# Altium project 2_Smoke_detector.PrjPcb (part 5 of 6)
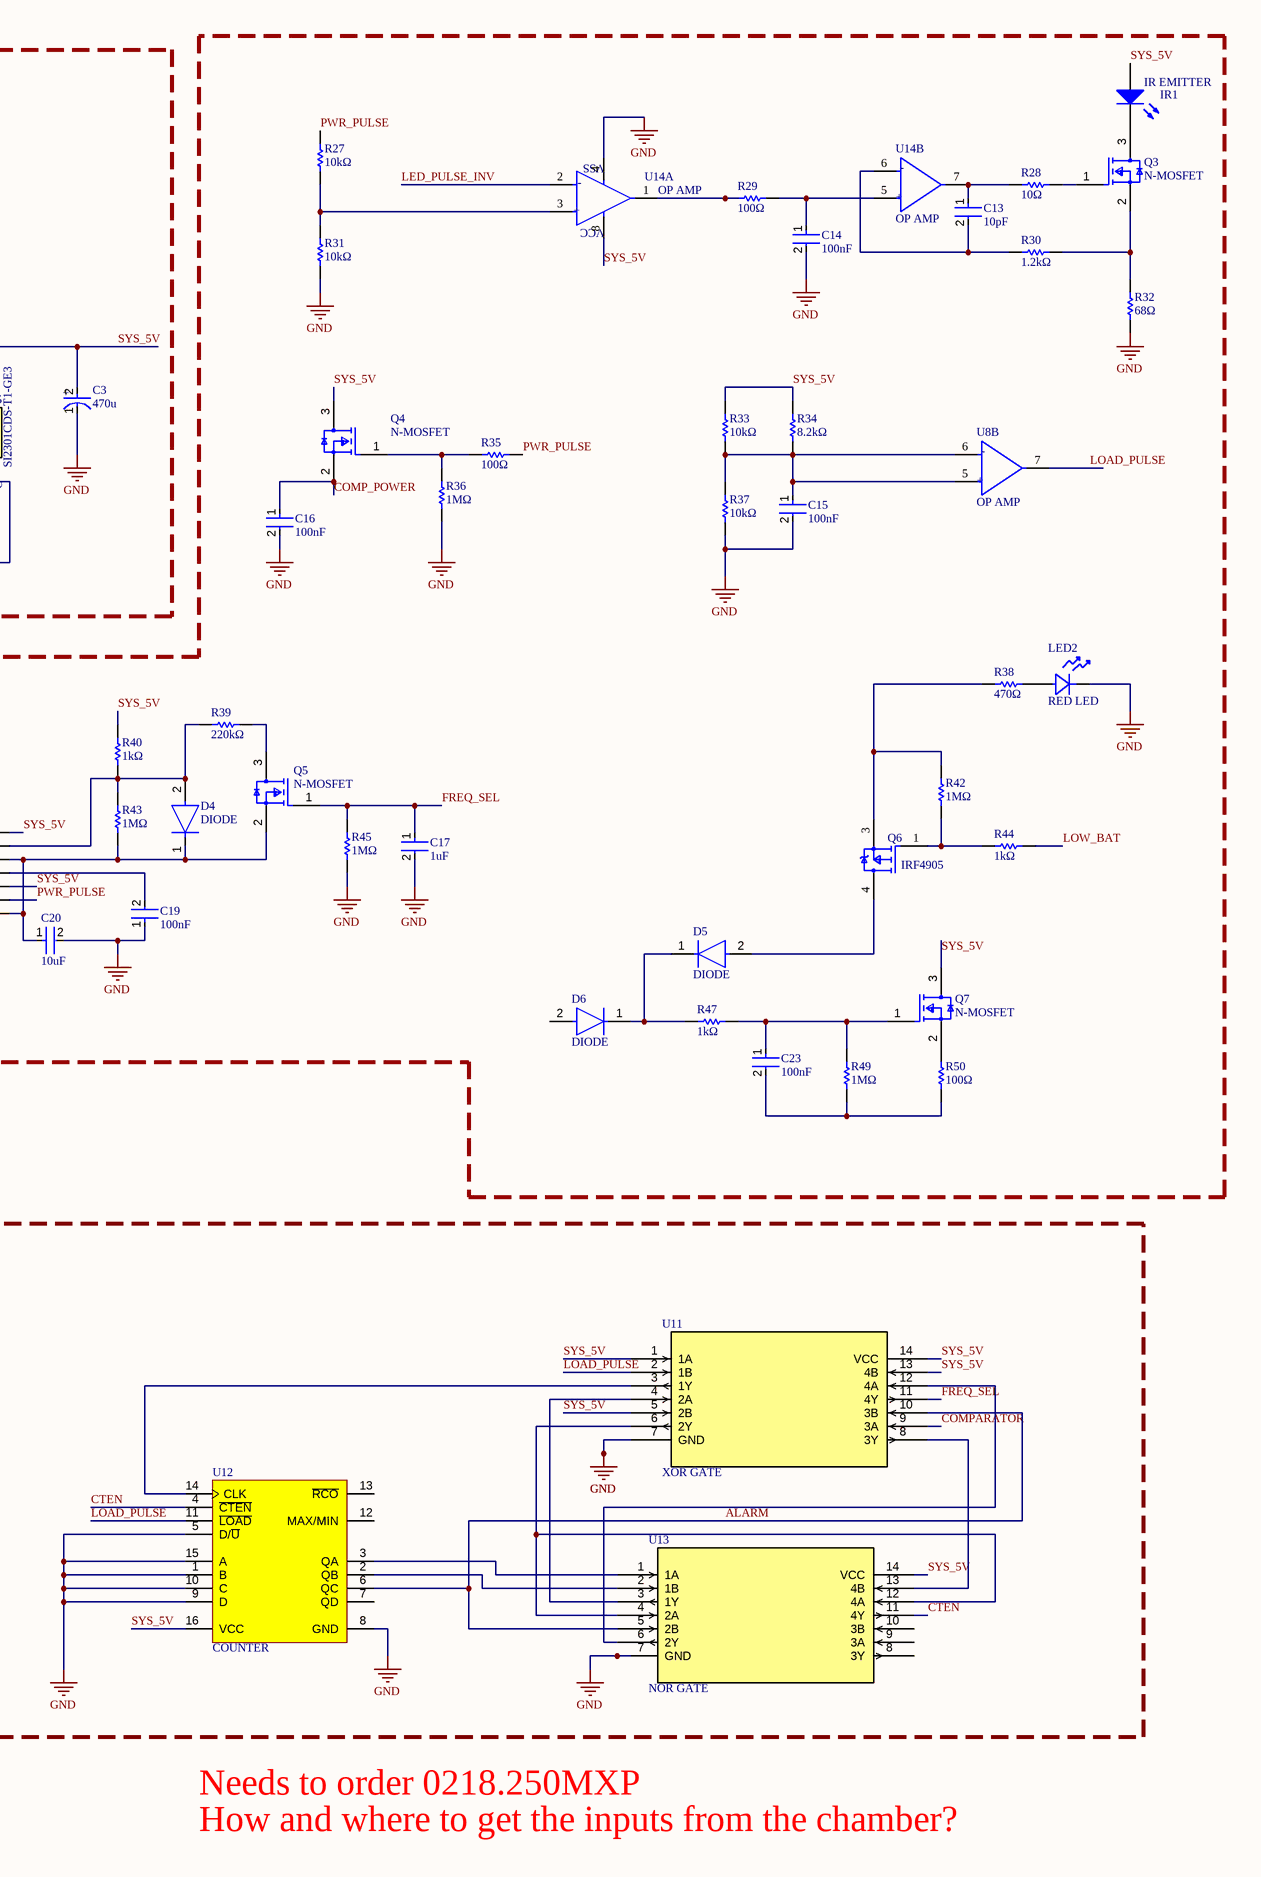
[diagram p5: 2_Smoke_detector.SchDoc, right]

## Sheet 2_Smoke_detector.SchDoc (continued)

### Library data of the parts (continued)
R19 R29 R35 R50 = CRCW0805100RFKEA: RES 100Ω ±1% 125mW 0805; Manufacturer: Vishay; Manufacturer Package Identifier: CRCW0805-e3; Temperature Coefficient: 100ppm/°C; Voltage Rating: 150V; Supplier: Future Electronics; Supplier Part Number: CRCW0805100RFKEA; Manufacturer Part Number: CRCW0805100RFKEA; RoHS: Compliant; Category: Chip SMD Resistors; Stock: 3045000; Pricing: 10000=0.0023, 50000=0.0022, 125000=0.0021, 375000=0.0021, 750000=0.002 (USD); Case/Package: 0805; Case Code (Imperial): 0805; China RoHS: Non-Compliant; Composition: Thick Film; Contact Plating: Tin; Country of Origin: Israel; Depth: 1.25mm; Export Control Classification Number (ECCN) Code: EAR99; Features: Automotive AEC-Q200; Height: 450µm; Harmonized Tariff Schedule (HTS) Code: 8533.21.00.30; Introduction Date: 2005-02-16; Lead Free: Lead Free; Length: 2mm; Lifecycle Status: Production; Max Operating Temperature: 155°C; Max Power Dissipation: 125mW; Military Standard: Not; Min Operating Temperature: -55°C; Mounting Technology: Surface Mount; Pins: 2; Number of Terminals: 2; Number of Terminations: 2; Power Rating: 125mW; Radiation Hardening: No; Ratings: AEC-Q200; REACH SVHC: Unaffected; Value: 100Ω; Schedule B: 8533210045, 8533210045|8533210045|8533210045|8533210045|8533210045|8533210045|8533210045|8533210045|8533210045|8533210045|8533210045|8533210045|8533210045|8533210045|8533210045|8533210045|8533210045|8533210045|8533210045|8533210045|8533210045|8533210045|8533210045|85; Termination: SMD/SMT; Tolerance: 1%; Voltage Rating (DC): 150V; Weight: 5.499807mg; Width: 1.25mm; Working Voltage: 150V; ComponentLink1URL: https://datasheet.octopart.com:443/CRCW0805100RFKEA-Vishay-datasheet-175423584.pdf?src-supplier=IHS; ComponentLink1Description: https://datasheet.octopart.com:443/CRCW0805100RFKEA-Vishay-datasheet-175423584.pdf?src-supplier=IHS; ComponentLink2URL: https://datasheet.octopart.com:443/CRCW0805100RFKEA-Vishay-datasheet-83961561.pdf?src-supplier=Newark; ComponentLink2Description: https://datasheet.octopart.com:443/CRCW0805100RFKEA-Vishay-datasheet-83961561.pdf?src-supplier=Newark; ComponentLink3URL: https://datasheet.octopart.com:443/CRCW0805100RFKEA-Vishay-datasheet-11516975.pdf?src-supplier=Newark; ComponentLink3Description: https://datasheet.octopart.com:443/CRCW0805100RFKEA-Vishay-datasheet-11516975.pdf?src-supplier=Newark; ComponentLink4URL: https://datasheet.octopart.com:443/CRCW0805100RFKEA-Vishay-datasheet-41302739.pdf?src-supplier=Newark; ComponentLink4Description: https://datasheet.octopart.com:443/CRCW0805100RFKEA-Vishay-datasheet-41302739.pdf?src-supplier=Newark; ComponentLink5URL: https://datasheet.octopart.com:443/CRCW0805100RFKEA-Vishay-datasheet-33013972.pdf?src-supplier=Newark; ComponentLink5Description: https://datasheet.octopart.com:443/CRCW0805100RFKEA-Vishay-datasheet-33013972.pdf?src-supplier=Newark; ComponentLink6URL: https://datasheet.octopart.com:443/CRCW0805100RFKEA-Vishay-datasheet-62317937.pdf?src-supplier=element14+APAC; ComponentLink6Description: https://datasheet.octopart.com:443/CRCW0805100RFKEA-Vishay-datasheet-62317937.pdf?src-supplier=element14+APAC; ComponentLink7URL: https://datasheet.octopart.com:443/CRCW0805100RFKEA-Vishay-datasheet-14722531.pdf?src-supplier=element14+APAC; ComponentLink7Description: https://datasheet.octopart.com:443/CRCW0805100RFKEA-Vishay-datasheet-14722531.pdf?src-supplier=element14+APAC; ComponentLink8URL: https://datasheet.octopart.com:443/CRCW0805100RFKEA.-Vishay-datasheet-78776209.pdf?src-supplier=element14+APAC; ComponentLink8Description: https://datasheet.octopart.com:443/CRCW0805100RFKEA.-Vishay-datasheet-78776209.pdf?src-supplier=element14+APAC; ComponentLink9URL: https://datasheet.octopart.com:443/CRCW0805100RFKEA-Vishay-datasheet-66077789.pdf?src-supplier=element14+APAC; ComponentLink9Description: https://datasheet.octopart.com:443/CRCW0805100RFKEA-Vishay-datasheet-66077789.pdf?src-supplier=element14+APAC; ComponentLink10URL: https://datasheet.octopart.com:443/CRCW0805100RFKEA-Vishay-datasheet-16179825.pdf?src-supplier=element14+APAC; ComponentLink10Description: https://datasheet.octopart.com:443/CRCW0805100RFKEA-Vishay-datasheet-16179825.pdf?src-supplier=element14+APAC; ComponentLink11URL: https://datasheet.octopart.com:443/CRCW0805100RFKEA-Vishay-datasheet-5300368.pdf?src-supplier=Future+Electronics; ComponentLink11Description: https://datasheet.octopart.com:443/CRCW0805100RFKEA-Vishay-datasheet-5300368.pdf?src-supplier=Future+Electronics; ComponentLink12URL: https://datasheet.octopart.com:443/CRCW0805100RFKEA-Vishay-datasheet-62316122.pdf?src-supplier=Future+Electronics; ComponentLink12Description: https://datasheet.octopart.com:443/CRCW0805100RFKEA-Vishay-datasheet-62316122.pdf?src-supplier=Future+Electronics; ComponentLink13URL: https://datasheet.octopart.com:443/CRCW0805100RFKEA-Vishay-datasheet-5306405.pdf?src-supplier=RS+(Formerly+Allied+Electronics); ComponentLink13Description: https://datasheet.octopart.com:443/CRCW0805100RFKEA-Vishay-datasheet-5306405.pdf?src-supplier=RS+(Formerly+Allied+Electronics); ComponentLink14URL: https://datasheet.octopart.com:443/CRCW0805100RFKEA-Vishay-Dale-datasheet-47688880.pdf?src-supplier=RS+(Formerly+Allied+Electronics); ComponentLink14Description: https://datasheet.octopart.com:443/CRCW0805100RFKEA-Vishay-Dale-datasheet-47688880.pdf?src-supplier=RS+(Formerly+Allied+Electronics); ComponentLink15URL: https://datasheet.octopart.com:443/CRCW0805100RFKEA-Vishay-datasheet-12001583.pdf?src-supplier=RS+(Formerly+Allied+Electronics); ComponentLink15Description: https://datasheet.octopart.com:443/CRCW0805100RFKEA-Vishay-datasheet-12001583.pdf?src-supplier=RS+(Formerly+Allied+Electronics); ComponentLink16URL: https://datasheet.octopart.com:443/CRCW0805100RFKEA-Vishay-datasheet-149165818.pdf?src-supplier=HQonline; ComponentLink16Description: https://datasheet.octopart.com:443/CRCW0805100RFKEA-Vishay-datasheet-149165818.pdf?src-supplier=HQonline; ComponentLink17URL: https://datasheet.octopart.com:443/CRCW0805100RFKEA-Vishay-datasheet-17834126.pdf?src-supplier=TME; ComponentLink17Description: https://datasheet.octopart.com:443/CRCW0805100RFKEA-Vishay-datasheet-17834126.pdf?src-supplier=TME; ComponentLink18URL: https://datasheet.octopart.com:443/CRCW0805100RFKEA-Vishay-datasheet-13242068.pdf?src-supplier=Farnell; ComponentLink18Description: https://datasheet.octopart.com:443/CRCW0805100RFKEA-Vishay-datasheet-13242068.pdf?src-supplier=Farnell; ComponentLink19URL: https://datasheet.octopart.com:443/CRCW0805100RFKEA-Vishay-datasheet-13195083.pdf?src-supplier=Farnell; ComponentLink19Description: https://datasheet.octopart.com:443/CRCW0805100RFKEA-Vishay-datasheet-13195083.pdf?src-supplier=Farnell; ComponentLink20URL: https://datasheet.octopart.com:443/CRCW0805100RFKEA-Vishay-datasheet-13034211.pdf?src-supplier=Farnell; ComponentLink20Description: https://datasheet.octopart.com:443/CRCW0805100RFKEA-Vishay-datasheet-13034211.pdf?src-supplier=Farnell; ComponentLink21URL: https://datasheet.octopart.com:443/CRCW0805100RFKEA-Vishay-datasheet-12600034.pdf?src-supplier=Farnell; ComponentLink21Description: https://datasheet.octopart.com:443/CRCW0805100RFKEA-Vishay-datasheet-12600034.pdf?src-supplier=Farnell; ComponentLink22URL: https://datasheet.octopart.com:443/CRCW0805100RFKEA-Vishay-datasheet-12532161.pdf?src-supplier=Farnell; ComponentLink22Description: https://datasheet.octopart.com:443/CRCW0805100RFKEA-Vishay-datasheet-12532161.pdf?src-supplier=Farnell; ComponentLink23URL: https://datasheet.octopart.com:443/CRCW0805100RFKEA-Vishay-datasheet-12517896.pdf?src-supplier=Farnell; ComponentLink23Description: https://datasheet.octopart.com:443/CRCW0805100RFKEA-Vishay-datasheet-12517896.pdf?src-supplier=Farnell; ComponentLink24URL: https://datasheet.octopart.com:443/CRCW0805100RFKEA-Vishay-datasheet-12509762.pdf?src-supplier=Farnell; ComponentLink24Description: https://datasheet.octopart.com:443/CRCW0805100RFKEA-Vishay-datasheet-12509762.pdf?src-supplier=Farnell; ComponentLink25URL: https://datasheet.octopart.com:443/CRCW0805100RFKEA-Vishay-datasheet-10322335.pdf?src-supplier=Farnell; ComponentLink25Description: https://datasheet.octopart.com:443/CRCW0805100RFKEA-Vishay-datasheet-10322335.pdf?src-supplier=Farnell; ComponentLink26URL: https://datasheet.octopart.com:443/CRCW0805100RFKEA-Vishay-datasheet-8788789.pdf?src-supplier=Farnell; ComponentLink26Description: https://datasheet.octopart.com:443/CRCW0805100RFKEA-Vishay-datasheet-8788789.pdf?src-supplier=Farnell; ComponentLink27URL: https://datasheet.octopart.com:443/CRCW0805100RFKEA-Vishay-datasheet-8361388.pdf?src-supplier=Farnell; ComponentLink27Description: https://datasheet.octopart.com:443/CRCW0805100RFKEA-Vishay-datasheet-8361388.pdf?src-supplier=Farnell; ComponentLink28URL: https://datasheet.octopart.com:443/CRCW0805100RFKEA-Vishay-datasheet-546287.pdf?src-supplier=Farnell; ComponentLink28Description: https://datasheet.octopart.com:443/CRCW0805100RFKEA-Vishay-datasheet-546287.pdf?src-supplier=Farnell; ComponentLink29URL: https://datasheet.octopart.com:443/CRCW0805100RFKEA-Vishay-datasheet-11540273.pdf?src-supplier=Arrow+Electronics; ComponentLink29Description: https://datasheet.octopart.com:443/CRCW0805100RFKEA-Vishay-datasheet-11540273.pdf?src-supplier=Arrow+Electronics; ComponentLink30URL: https://datasheet.octopart.com:443/CRCW0805100RFKEA-Vishay-datasheet-8445837.pdf?src-supplier=element14; ComponentLink30Description: https://datasheet.octopart.com:443/CRCW0805100RFKEA-Vishay-datasheet-8445837.pdf?src-supplier=element14; ComponentLink31URL: https://datasheet.octopart.com:443/CRCW0805100RFKEA-Vishay-datasheet-5377306.pdf?src-supplier=Garrett; ComponentLink31Description: https://datasheet.octopart.com:443/CRCW0805100RFKEA-Vishay-datasheet-5377306.pdf?src-supplier=Garrett; ComponentLink32URL: https://datasheet.octopart.com:443/CRCW0805100RFKEA-Vishay-datasheet-148188.pdf?src-supplier=Garrett; ComponentLink32Description: https://datasheet.octopart.com:443/CRCW0805100RFKEA-Vishay-datasheet-148188.pdf?src-supplier=Garrett; ComponentLink33URL: https://datasheet.octopart.com:443/CRCW0805100RFKEA-Vishay-datasheet-34203.pdf?src-supplier=Garrett; ComponentLink33Description: https://datasheet.octopart.com:443/CRCW0805100RFKEA-Vishay-datasheet-34203.pdf?src-supplier=Garrett; ComponentLink34URL: http://sigma.octopart.com:80/rohs_statement/Vishay-company-15.pdf?src-supplier=Compliance+Statements; ComponentLink34Description: http://sigma.octopart.com:80/rohs_statement/Vishay-company-15.pdf?src-supplier=Compliance+Statements; LCSC Part Number: C844936
R21 = RC0805FR-07499KL: RES 499kΩ ±1% 125mW 0805; Manufacturer: Yageo Group; Temperature Coefficient: 100ppm/°C; Voltage Rating: 150V; Supplier: Future Electronics; Supplier Part Number: RC0805FR-07499KL; Manufacturer Part Number: RC0805FR-07499KL; RoHS: Compliant; Category: Chip SMD Resistors; Stock: 850000; Pricing: 5000=0.0068, 20000=0.0066, 75000=0.0064, 150000=0.0063, 375000=0.006 (USD); Case/Package: 0805; Case Code (Imperial): 0805; China RoHS: Non-Compliant; Composition: Thick Film; Contact Plating: Lead, Tin; Country of Origin: Mainland China, Taiwan; Depth: 1.25mm; Export Control Classification Number (ECCN) Code: EAR99; Height: 500µm; Harmonized Tariff Schedule (HTS) Code: 8533.21.00.30; Introduction Date: 2004-09-22; Lead Free: Lead Free; Length: 2mm; Lifecycle Status: Production; Max Operating Temperature: 155°C; Military Standard: Not; Min Operating Temperature: -55°C; Mounting Technology: Surface Mount; Number of Terminals: 2; Packaging: Tape & Reel; Power Rating: 125mW; Radiation Hardening: No; REACH SVHC: Unaffected; Value: 499kΩ; Schedule B: 8533210045, 8533210045|8533210045, 8533210045|8533210045|8533210045, 8533210045|8533210045|8533210045|8533210045; Termination: SMD/SMT; Tolerance: 1%; Voltage Rating (DC): 150V; Width: 1.25mm; Working Voltage: 150V; ComponentLink1URL: https://datasheet.octopart.com:443/RC0805FR-07499KL-Yageo-datasheet-175887523.pdf?src-supplier=Newark; ComponentLink1Description: https://datasheet.octopart.com:443/RC0805FR-07499KL-Yageo-datasheet-175887523.pdf?src-supplier=Newark; ComponentLink2URL: https://datasheet.octopart.com:443/RC0805FR-07499KL-Yageo-datasheet-103092701.pdf?src-supplier=Upverter; ComponentLink2Description: https://datasheet.octopart.com:443/RC0805FR-07499KL-Yageo-datasheet-103092701.pdf?src-supplier=Upverter; ComponentLink3URL: https://datasheet.octopart.com:443/RC0805FR-07499KL-Yageo-Group-datasheet-190305687.pdf?src-supplier=Future+Electronics; ComponentLink3Description: https://datasheet.octopart.com:443/RC0805FR-07499KL-Yageo-Group-datasheet-190305687.pdf?src-supplier=Future+Electronics; ComponentLink4URL: https://datasheet.octopart.com:443/RC0805FR-07499KL-Yageo-datasheet-164759695.pdf?src-supplier=Future+Electronics; ComponentLink4Description: https://datasheet.octopart.com:443/RC0805FR-07499KL-Yageo-datasheet-164759695.pdf?src-supplier=Future+Electronics; ComponentLink5URL: https://datasheet.octopart.com:443/RC0805FR-07499KL-Yageo-datasheet-12592811.pdf?src-supplier=Future+Electronics; ComponentLink5Description: https://datasheet.octopart.com:443/RC0805FR-07499KL-Yageo-datasheet-12592811.pdf?src-supplier=Future+Electronics; ComponentLink6URL: https://datasheet.octopart.com:443/RC0805FR-07499KL-Yageo-datasheet-8324252.pdf?src-supplier=Future+Electronics; ComponentLink6Description: https://datasheet.octopart.com:443/RC0805FR-07499KL-Yageo-datasheet-8324252.pdf?src-supplier=Future+Electronics; ComponentLink7URL: https://datasheet.octopart.com:443/RC0805FR-07499KL-Yageo-datasheet-8330313.pdf?src-supplier=TME; ComponentLink7Description: https://datasheet.octopart.com:443/RC0805FR-07499KL-Yageo-datasheet-8330313.pdf?src-supplier=TME; ComponentLink8URL: https://datasheet.octopart.com:443/RC0805FR-07499KL-Yageo-datasheet-79472498.pdf?src-supplier=Megastar; ComponentLink8Description: https://datasheet.octopart.com:443/RC0805FR-07499KL-Yageo-datasheet-79472498.pdf?src-supplier=Megastar; ComponentLink9URL: https://datasheet.octopart.com/RC0805FR-07499KL-Yageo-datasheet-73766026.pdf; ComponentLink9Description: https://datasheet.octopart.com/RC0805FR-07499KL-Yageo-datasheet-73766026.pdf; ComponentLink10URL: https://datasheet.octopart.com:443/RC0805FR-07499KL-Yageo-datasheet-118657.pdf?src-supplier=DigiKey; ComponentLink10Description: https://datasheet.octopart.com:443/RC0805FR-07499KL-Yageo-datasheet-118657.pdf?src-supplier=DigiKey; ComponentLink11URL: http://sigma.octopart.com:80/conflict_mineral_statement/Yageo-company-3.pdf?src-supplier=Compliance+Statements; ComponentLink11Description: http://sigma.octopart.com:80/conflict_mineral_statement/Yageo-company-3.pdf?src-supplier=Compliance+Statements; ComponentLink12URL: http://sigma.octopart.com:80/rohs_statement/Yageo-company-2.pdf?src-supplier=Compliance+Statements; ComponentLink12Description: http://sigma.octopart.com:80/rohs_statement/Yageo-company-2.pdf?src-supplier=Compliance+Statements; LCSC: C274360; LCSC Part Number: C274360
R26 = CRCW080522K0FKEAC: RES 22kΩ 1% 1/8W 0805; Manufacturer: Vishay; Power Rating: 125mW; Temperature Coefficient: 100ppm/°C; Working Voltage: 150V; Supplier: Avnet; Supplier Part Number: CRCW080522K0FKEAC; Manufacturer Part Number: CRCW080522K0FKEAC; RoHS: Compliant; Category: Chip SMD Resistors; Stock: 85000; Pricing: 5000=0.00893, 100000=0.00478, 200000=0.00475, 400000=0.00473, 800000=0.0047 (USD); Case/Package: 0805; China RoHS: Non-Compliant; Composition: Thick Film; Contact Plating: Tin; Height: 500µm; Lead Free: Lead Free; Length: 2mm; Lifecycle Status: Production; Max Operating Temperature: 155°C; Min Operating Temperature: -55°C; Mounting Technology: Surface Mount; Number of Terminals: 2; REACH SVHC: Unaffected; Value: 22kΩ; Schedule B: 8533210045, 8533210045|8533210045|8533210045|8533210045|8533210045; Termination: Wraparound; Tolerance: 1%; Width: 1.25mm; ComponentLink1URL: https://datasheet.octopart.com:443/CRCW080522K0FKEAC-Vishay-datasheet-175423585.pdf?src-supplier=IHS; ComponentLink1Description: https://datasheet.octopart.com:443/CRCW080522K0FKEAC-Vishay-datasheet-175423585.pdf?src-supplier=IHS; ComponentLink2URL: https://datasheet.octopart.com:443/CRCW080522K0FKEAC-Vishay-datasheet-102570912.pdf?src-supplier=LCSC; ComponentLink2Description: https://datasheet.octopart.com:443/CRCW080522K0FKEAC-Vishay-datasheet-102570912.pdf?src-supplier=LCSC; ComponentLink3URL: https://datasheet.octopart.com:443/CRCW080522K0FKEAC-Vishay-datasheet-62316122.pdf?src-supplier=Future+Electronics; ComponentLink3Description: https://datasheet.octopart.com:443/CRCW080522K0FKEAC-Vishay-datasheet-62316122.pdf?src-supplier=Future+Electronics; ComponentLink4URL: http://sigma.octopart.com:80/rohs_statement/Vishay-company-15.pdf?src-supplier=Compliance+Statements; ComponentLink4Description: http://sigma.octopart.com:80/rohs_statement/Vishay-company-15.pdf?src-supplier=Compliance+Statements; LCSC Part Number: C844401
R28 = CRCW080510R0FKEA: RES 10Ω ±1% 125mW 0805; Manufacturer: Vishay; Manufacturer Package Identifier: CRCW0805-e3; Temperature Coefficient: 100ppm/°C; Voltage Rating: 150V; Supplier: Future Electronics; Supplier Part Number: CRCW080510R0FKEA; Manufacturer Part Number: CRCW080510R0FKEA; RoHS: Compliant; Category: Chip SMD Resistors; Stock: 2860000; Pricing: 10000=0.0023, 50000=0.0022, 125000=0.0022, 375000=0.0021, 750000=0.002 (USD); Case/Package: 0805; Case Code (Imperial): 0805; China RoHS: Non-Compliant; Composition: Thick Film; Contact Plating: Lead, Tin; Country of Origin: Israel; Depth: 1.25mm; Export Control Classification Number (ECCN) Code: EAR99; Features: Automotive AEC-Q200; Height: 450µm; Harmonized Tariff Schedule (HTS) Code: 8533.21.00.30; Introduction Date: 2005-02-16; Lead Free: Lead Free; Length: 2mm; Lifecycle Status: Production; Max Operating Temperature: 155°C; Max Power Dissipation: 125mW; Military Standard: Not; Min Operating Temperature: -55°C; Mounting Technology: Surface Mount; Pins: 2; Number of Terminals: 2; Number of Terminations: 2; Packaging: Cut Tape; Power Rating: 125mW; Radiation Hardening: No; Ratings: AEC-Q200; REACH SVHC: Unaffected; Value: 10Ω; Schedule B: 8533210045, 8533210045|8533210045|8533210045|8533210045|8533210045|8533210045|8533210045|8533210045|8533210045|8533210045|8533210045|8533210045|8533210045|8533210045|8533210045|8533210045|8533210045|8533210045|8533210045|8533210045|8533210045|8533210045|8533210045|85; Termination: SMD/SMT; Tolerance: 1%; Voltage Rating (DC): 150V; Weight: 5.499807mg; Width: 1.25mm; Working Voltage: 150V; ComponentLink1URL: https://datasheet.octopart.com:443/CRCW080510R0FKEA-Vishay-datasheet-175423584.pdf?src-supplier=IHS; ComponentLink1Description: https://datasheet.octopart.com:443/CRCW080510R0FKEA-Vishay-datasheet-175423584.pdf?src-supplier=IHS; ComponentLink2URL: https://datasheet.octopart.com:443/CRCW080510R0FKEA-Vishay-datasheet-83961561.pdf?src-supplier=Newark; ComponentLink2Description: https://datasheet.octopart.com:443/CRCW080510R0FKEA-Vishay-datasheet-83961561.pdf?src-supplier=Newark; ComponentLink3URL: https://datasheet.octopart.com:443/CRCW080510R0FKEA-Vishay-datasheet-11516975.pdf?src-supplier=Newark; ComponentLink3Description: https://datasheet.octopart.com:443/CRCW080510R0FKEA-Vishay-datasheet-11516975.pdf?src-supplier=Newark; ComponentLink4URL: https://datasheet.octopart.com:443/CRCW080510R0FKEA-Vishay-datasheet-41302739.pdf?src-supplier=Newark; ComponentLink4Description: https://datasheet.octopart.com:443/CRCW080510R0FKEA-Vishay-datasheet-41302739.pdf?src-supplier=Newark; ComponentLink5URL: https://datasheet.octopart.com:443/CRCW080510R0FKEA-Vishay-datasheet-33013972.pdf?src-supplier=Newark; ComponentLink5Description: https://datasheet.octopart.com:443/CRCW080510R0FKEA-Vishay-datasheet-33013972.pdf?src-supplier=Newark; ComponentLink6URL: https://datasheet.octopart.com:443/CRCW080510R0FKEA-Vishay-datasheet-62317937.pdf?src-supplier=element14+APAC; ComponentLink6Description: https://datasheet.octopart.com:443/CRCW080510R0FKEA-Vishay-datasheet-62317937.pdf?src-supplier=element14+APAC; ComponentLink7URL: https://datasheet.octopart.com:443/CRCW080510R0FKEA-Vishay-datasheet-14722531.pdf?src-supplier=element14+APAC; ComponentLink7Description: https://datasheet.octopart.com:443/CRCW080510R0FKEA-Vishay-datasheet-14722531.pdf?src-supplier=element14+APAC; ComponentLink8URL: https://datasheet.octopart.com:443/CRCW080510R0FKEA.-Vishay-datasheet-78776209.pdf?src-supplier=element14+APAC; ComponentLink8Description: https://datasheet.octopart.com:443/CRCW080510R0FKEA.-Vishay-datasheet-78776209.pdf?src-supplier=element14+APAC; ComponentLink9URL: https://datasheet.octopart.com:443/CRCW080510R0FKEA-Vishay-datasheet-66077789.pdf?src-supplier=element14+APAC; ComponentLink9Description: https://datasheet.octopart.com:443/CRCW080510R0FKEA-Vishay-datasheet-66077789.pdf?src-supplier=element14+APAC; ComponentLink10URL: https://datasheet.octopart.com:443/CRCW080510R0FKEA-Vishay-datasheet-16179825.pdf?src-supplier=element14+APAC; ComponentLink10Description: https://datasheet.octopart.com:443/CRCW080510R0FKEA-Vishay-datasheet-16179825.pdf?src-supplier=element14+APAC; ComponentLink11URL: https://datasheet.octopart.com:443/CRCW080510R0FKEA-Vishay-datasheet-5306405.pdf?src-supplier=Future+Electronics; ComponentLink11Description: https://datasheet.octopart.com:443/CRCW080510R0FKEA-Vishay-datasheet-5306405.pdf?src-supplier=Future+Electronics; ComponentLink12URL: https://datasheet.octopart.com:443/CRCW080510R0FKEA-Vishay-datasheet-13242068.pdf?src-supplier=Future+Electronics; ComponentLink12Description: https://datasheet.octopart.com:443/CRCW080510R0FKEA-Vishay-datasheet-13242068.pdf?src-supplier=Future+Electronics; ComponentLink13URL: https://datasheet.octopart.com:443/CRCW080510R0FKEA-Vishay-datasheet-13195083.pdf?src-supplier=Future+Electronics; ComponentLink13Description: https://datasheet.octopart.com:443/CRCW080510R0FKEA-Vishay-datasheet-13195083.pdf?src-supplier=Future+Electronics; ComponentLink14URL: https://datasheet.octopart.com:443/CRCW080510R0FKEA-Vishay-datasheet-13034211.pdf?src-supplier=Future+Electronics; ComponentLink14Description: https://datasheet.octopart.com:443/CRCW080510R0FKEA-Vishay-datasheet-13034211.pdf?src-supplier=Future+Electronics; ComponentLink15URL: https://datasheet.octopart.com:443/CRCW080510R0FKEA-Vishay-datasheet-12600034.pdf?src-supplier=Future+Electronics; ComponentLink15Description: https://datasheet.octopart.com:443/CRCW080510R0FKEA-Vishay-datasheet-12600034.pdf?src-supplier=Future+Electronics; ComponentLink16URL: https://datasheet.octopart.com:443/CRCW080510R0FKEA-Vishay-datasheet-12532161.pdf?src-supplier=Future+Electronics; ComponentLink16Description: https://datasheet.octopart.com:443/CRCW080510R0FKEA-Vishay-datasheet-12532161.pdf?src-supplier=Future+Electronics; ComponentLink17URL: https://datasheet.octopart.com:443/CRCW080510R0FKEA-Vishay-datasheet-12509762.pdf?src-supplier=Future+Electronics; ComponentLink17Description: https://datasheet.octopart.com:443/CRCW080510R0FKEA-Vishay-datasheet-12509762.pdf?src-supplier=Future+Electronics; ComponentLink18URL: https://datasheet.octopart.com:443/CRCW080510R0FKEA-Vishay-datasheet-10322335.pdf?src-supplier=Future+Electronics; ComponentLink18Description: https://datasheet.octopart.com:443/CRCW080510R0FKEA-Vishay-datasheet-10322335.pdf?src-supplier=Future+Electronics; ComponentLink19URL: https://datasheet.octopart.com:443/CRCW080510R0FKEA-Vishay-datasheet-8788789.pdf?src-supplier=Future+Electronics; ComponentLink19Description: https://datasheet.octopart.com:443/CRCW080510R0FKEA-Vishay-datasheet-8788789.pdf?src-supplier=Future+Electronics; ComponentLink20URL: https://datasheet.octopart.com:443/CRCW080510R0FKEA-Vishay-datasheet-8361388.pdf?src-supplier=Future+Electronics; ComponentLink20Description: https://datasheet.octopart.com:443/CRCW080510R0FKEA-Vishay-datasheet-8361388.pdf?src-supplier=Future+Electronics; ComponentLink21URL: https://datasheet.octopart.com:443/CRCW080510R0FKEA-Vishay-datasheet-5300368.pdf?src-supplier=Future+Electronics; ComponentLink21Description: https://datasheet.octopart.com:443/CRCW080510R0FKEA-Vishay-datasheet-5300368.pdf?src-supplier=Future+Electronics; ComponentLink22URL: https://datasheet.octopart.com:443/CRCW080510R0FKEA-Vishay-datasheet-546287.pdf?src-supplier=Future+Electronics; ComponentLink22Description: https://datasheet.octopart.com:443/CRCW080510R0FKEA-Vishay-datasheet-546287.pdf?src-supplier=Future+Electronics; ComponentLink23URL: https://datasheet.octopart.com:443/CRCW080510R0FKEA-Vishay-datasheet-62316122.pdf?src-supplier=Future+Electronics; ComponentLink23Description: https://datasheet.octopart.com:443/CRCW080510R0FKEA-Vishay-datasheet-62316122.pdf?src-supplier=Future+Electronics; ComponentLink24URL: https://datasheet.octopart.com:443/CRCW080510R0FKEA-Vishay-datasheet-12517896.pdf?src-supplier=Farnell; ComponentLink24Description: https://datasheet.octopart.com:443/CRCW080510R0FKEA-Vishay-datasheet-12517896.pdf?src-supplier=Farnell; ComponentLink25URL: https://datasheet.octopart.com:443/CRCW080510R0FKEA-Vishay-datasheet-149165818.pdf?src-supplier=HQonline; ComponentLink25Description: https://datasheet.octopart.com:443/CRCW080510R0FKEA-Vishay-datasheet-149165818.pdf?src-supplier=HQonline; ComponentLink26URL: https://datasheet.octopart.com:443/CRCW080510R0FKEA-Vishay-Dale-datasheet-47688880.pdf?src-supplier=RS+(Formerly+Allied+Electronics); ComponentLink26Description: https://datasheet.octopart.com:443/CRCW080510R0FKEA-Vishay-Dale-datasheet-47688880.pdf?src-supplier=RS+(Formerly+Allied+Electronics); ComponentLink27URL: https://datasheet.octopart.com:443/CRCW080510R0FKEA-Vishay-datasheet-12001583.pdf?src-supplier=RS+(Formerly+Allied+Electronics); ComponentLink27Description: https://datasheet.octopart.com:443/CRCW080510R0FKEA-Vishay-datasheet-12001583.pdf?src-supplier=RS+(Formerly+Allied+Electronics); ComponentLink28URL: https://datasheet.octopart.com:443/CRCW080510R0FKEA-Vishay-datasheet-17834126.pdf?src-supplier=TME; ComponentLink28Description: https://datasheet.octopart.com:443/CRCW080510R0FKEA-Vishay-datasheet-17834126.pdf?src-supplier=TME; ComponentLink29URL: https://datasheet.octopart.com:443/CRCW080510R0FKEA-Vishay-datasheet-8445837.pdf?src-supplier=element14; ComponentLink29Description: https://datasheet.octopart.com:443/CRCW080510R0FKEA-Vishay-datasheet-8445837.pdf?src-supplier=element14; ComponentLink30URL: https://datasheet.octopart.com:443/CRCW080510R0FKEA-Vishay-datasheet-5377306.pdf?src-supplier=Garrett; ComponentLink30Description: https://datasheet.octopart.com:443/CRCW080510R0FKEA-Vishay-datasheet-5377306.pdf?src-supplier=Garrett; ComponentLink31URL: https://datasheet.octopart.com:443/CRCW080510R0FKEA-Vishay-datasheet-148188.pdf?src-supplier=Garrett; ComponentLink31Description: https://datasheet.octopart.com:443/CRCW080510R0FKEA-Vishay-datasheet-148188.pdf?src-supplier=Garrett; ComponentLink32URL: https://datasheet.octopart.com:443/CRCW080510R0FKEA-Vishay-datasheet-34203.pdf?src-supplier=Garrett; ComponentLink32Description: https://datasheet.octopart.com:443/CRCW080510R0FKEA-Vishay-datasheet-34203.pdf?src-supplier=Garrett; ComponentLink33URL: http://sigma.octopart.com:80/rohs_statement/Vishay-company-15.pdf?src-supplier=Compliance+Statements; ComponentLink33Description: http://sigma.octopart.com:80/rohs_statement/Vishay-company-15.pdf?src-supplier=Compliance+Statements; LCSC Part Number: C844938
R30 = FRC0805J122 TS: RES 1.2kΩ ±5% 125mW 0805; Value: 1.2kΩ; LCSC Part Number: C2933520
R32 = FRC0805F68R0TS: RES 68Ω ±1% 125mW 0805; LCSC Part Number: C2933487; Value: 68Ω
R34 = CRCW08058K20FKEA: RES 8.2kΩ ±1% 125mW 0805; Manufacturer: Vishay; Manufacturer Package Identifier: CRCW0805-e3; Temperature Coefficient: 100ppm/°C; Voltage Rating: 150V; Supplier: Future Electronics; Supplier Part Number: CRCW08058K20FKEA; Manufacturer Part Number: CRCW08058K20FKEA; RoHS: Compliant; Category: Chip SMD Resistors; Stock: 90000; Pricing: 5000=0.0094, 20000=0.009, 50000=0.0088, 125000=0.0086, 200000=0.0083 (USD); Case/Package: 0805; Case Code (Imperial): 0805; China RoHS: Non-Compliant; Composition: Thick Film; Contact Plating: Tin; Depth: 1.25mm; Height: 450µm; Lead Free: Lead Free; Length: 2mm; Lifecycle Status: Production; Max Operating Temperature: 155°C; Military Standard: Not; Min Operating Temperature: -55°C; Mounting Technology: Surface Mount; Pins: 2; Number of Terminals: 2; Packaging: Cut Tape; Power Rating: 125mW; Radiation Hardening: No; Ratings: AEC-Q200; REACH SVHC: Unaffected; Value: 8.2kΩ; Schedule B: 8533210045, 8533210045|8533210045, 8533210045|8533210045|8533210045, 8533210045|8533210045|8533210045|8533210045; Termination: SMD/SMT; Tolerance: 1%; Voltage Rating (DC): 150V; Weight: 5.499807mg; Width: 1.25mm; Working Voltage: 150V; ComponentLink1URL: https://datasheet.octopart.com:443/CRCW08058K20FKEA-Vishay-datasheet-175423584.pdf?src-supplier=IHS; ComponentLink1Description: https://datasheet.octopart.com:443/CRCW08058K20FKEA-Vishay-datasheet-175423584.pdf?src-supplier=IHS; ComponentLink2URL: https://datasheet.octopart.com:443/CRCW08058K20FKEA-Vishay-datasheet-83961561.pdf?src-supplier=element14+APAC; ComponentLink2Description: https://datasheet.octopart.com:443/CRCW08058K20FKEA-Vishay-datasheet-83961561.pdf?src-supplier=element14+APAC; ComponentLink3URL: https://datasheet.octopart.com:443/CRCW08058K20FKEA-Vishay-datasheet-62317937.pdf?src-supplier=element14+APAC; ComponentLink3Description: https://datasheet.octopart.com:443/CRCW08058K20FKEA-Vishay-datasheet-62317937.pdf?src-supplier=element14+APAC; ComponentLink4URL: https://datasheet.octopart.com:443/CRCW08058K20FKEA-Vishay-datasheet-14722531.pdf?src-supplier=element14+APAC; ComponentLink4Description: https://datasheet.octopart.com:443/CRCW08058K20FKEA-Vishay-datasheet-14722531.pdf?src-supplier=element14+APAC; ComponentLink5URL: https://datasheet.octopart.com:443/CRCW08058K20FKEA.-Vishay-datasheet-78776209.pdf?src-supplier=element14+APAC; ComponentLink5Description: https://datasheet.octopart.com:443/CRCW08058K20FKEA.-Vishay-datasheet-78776209.pdf?src-supplier=element14+APAC; ComponentLink6URL: https://datasheet.octopart.com:443/CRCW08058K20FKEA-Vishay-datasheet-66077789.pdf?src-supplier=element14+APAC; ComponentLink6Description: https://datasheet.octopart.com:443/CRCW08058K20FKEA-Vishay-datasheet-66077789.pdf?src-supplier=element14+APAC; ComponentLink7URL: https://datasheet.octopart.com:443/CRCW08058K20FKEA-Vishay-datasheet-31669108.pdf?src-supplier=Farnell; ComponentLink7Description: https://datasheet.octopart.com:443/CRCW08058K20FKEA-Vishay-datasheet-31669108.pdf?src-supplier=Farnell; ComponentLink8URL: https://datasheet.octopart.com:443/CRCW08058K20FKEA-Vishay-datasheet-13242068.pdf?src-supplier=Farnell; ComponentLink8Description: https://datasheet.octopart.com:443/CRCW08058K20FKEA-Vishay-datasheet-13242068.pdf?src-supplier=Farnell; ComponentLink9URL: https://datasheet.octopart.com:443/CRCW08058K20FKEA-Vishay-datasheet-13195083.pdf?src-supplier=Farnell; ComponentLink9Description: https://datasheet.octopart.com:443/CRCW08058K20FKEA-Vishay-datasheet-13195083.pdf?src-supplier=Farnell; ComponentLink10URL: https://datasheet.octopart.com:443/CRCW08058K20FKEA-Vishay-datasheet-13034211.pdf?src-supplier=Farnell; ComponentLink10Description: https://datasheet.octopart.com:443/CRCW08058K20FKEA-Vishay-datasheet-13034211.pdf?src-supplier=Farnell; ComponentLink11URL: https://datasheet.octopart.com:443/CRCW08058K20FKEA-Vishay-datasheet-12600034.pdf?src-supplier=Farnell; ComponentLink11Description: https://datasheet.octopart.com:443/CRCW08058K20FKEA-Vishay-datasheet-12600034.pdf?src-supplier=Farnell; ComponentLink12URL: https://datasheet.octopart.com:443/CRCW08058K20FKEA-Vishay-datasheet-12532161.pdf?src-supplier=Farnell; ComponentLink12Description: https://datasheet.octopart.com:443/CRCW08058K20FKEA-Vishay-datasheet-12532161.pdf?src-supplier=Farnell; ComponentLink13URL: https://datasheet.octopart.com:443/CRCW08058K20FKEA-Vishay-datasheet-12517896.pdf?src-supplier=Farnell; ComponentLink13Description: https://datasheet.octopart.com:443/CRCW08058K20FKEA-Vishay-datasheet-12517896.pdf?src-supplier=Farnell; ComponentLink14URL: https://datasheet.octopart.com:443/CRCW08058K20FKEA-Vishay-datasheet-12509762.pdf?src-supplier=Farnell; ComponentLink14Description: https://datasheet.octopart.com:443/CRCW08058K20FKEA-Vishay-datasheet-12509762.pdf?src-supplier=Farnell; ComponentLink15URL: https://datasheet.octopart.com:443/CRCW08058K20FKEA-Vishay-datasheet-10322335.pdf?src-supplier=Farnell; ComponentLink15Description: https://datasheet.octopart.com:443/CRCW08058K20FKEA-Vishay-datasheet-10322335.pdf?src-supplier=Farnell; ComponentLink16URL: https://datasheet.octopart.com:443/CRCW08058K20FKEA-Vishay-datasheet-8788789.pdf?src-supplier=Farnell; ComponentLink16Description: https://datasheet.octopart.com:443/CRCW08058K20FKEA-Vishay-datasheet-8788789.pdf?src-supplier=Farnell; ComponentLink17URL: https://datasheet.octopart.com:443/CRCW08058K20FKEA-Vishay-datasheet-8361388.pdf?src-supplier=Farnell; ComponentLink17Description: https://datasheet.octopart.com:443/CRCW08058K20FKEA-Vishay-datasheet-8361388.pdf?src-supplier=Farnell; ComponentLink18URL: https://datasheet.octopart.com:443/CRCW08058K20FKEA-Vishay-datasheet-546287.pdf?src-supplier=Farnell; ComponentLink18Description: https://datasheet.octopart.com:443/CRCW08058K20FKEA-Vishay-datasheet-546287.pdf?src-supplier=Farnell; ComponentLink19URL: https://datasheet.octopart.com:443/CRCW08058K20FKEA-Vishay-datasheet-11516975.pdf?src-supplier=Newark; ComponentLink19Description: https://datasheet.octopart.com:443/CRCW08058K20FKEA-Vishay-datasheet-11516975.pdf?src-supplier=Newark; ComponentLink20URL: https://datasheet.octopart.com:443/CRCW08058K20FKEA-Vishay-datasheet-41302739.pdf?src-supplier=Newark; ComponentLink20Description: https://datasheet.octopart.com:443/CRCW08058K20FKEA-Vishay-datasheet-41302739.pdf?src-supplier=Newark; ComponentLink21URL: https://datasheet.octopart.com:443/CRCW08058K20FKEA-Vishay-datasheet-33013972.pdf?src-supplier=Newark; ComponentLink21Description: https://datasheet.octopart.com:443/CRCW08058K20FKEA-Vishay-datasheet-33013972.pdf?src-supplier=Newark; ComponentLink22URL: https://datasheet.octopart.com:443/CRCW08058K20FKEA-Vishay-datasheet-5300368.pdf?src-supplier=Future+Electronics; ComponentLink22Description: https://datasheet.octopart.com:443/CRCW08058K20FKEA-Vishay-datasheet-5300368.pdf?src-supplier=Future+Electronics; ComponentLink23URL: https://datasheet.octopart.com:443/CRCW08058K20FKEA-Vishay-datasheet-62316122.pdf?src-supplier=Future+Electronics; ComponentLink23Description: https://datasheet.octopart.com:443/CRCW08058K20FKEA-Vishay-datasheet-62316122.pdf?src-supplier=Future+Electronics; ComponentLink24URL: https://datasheet.octopart.com:443/CRCW08058K20FKEA-Vishay-datasheet-5306405.pdf?src-supplier=RS+(Formerly+Allied+Electronics); ComponentLink24Description: https://datasheet.octopart.com:443/CRCW08058K20FKEA-Vishay-datasheet-5306405.pdf?src-supplier=RS+(Formerly+Allied+Electronics); ComponentLink25URL: https://datasheet.octopart.com:443/CRCW08058K20FKEA-Vishay-Dale-datasheet-47688880.pdf?src-supplier=RS+(Formerly+Allied+Electronics); ComponentLink25Description: https://datasheet.octopart.com:443/CRCW08058K20FKEA-Vishay-Dale-datasheet-47688880.pdf?src-supplier=RS+(Formerly+Allied+Electronics); ComponentLink26URL: https://datasheet.octopart.com:443/CRCW08058K20FKEA-Vishay-datasheet-12001583.pdf?src-supplier=RS+(Formerly+Allied+Electronics); ComponentLink26Description: https://datasheet.octopart.com:443/CRCW08058K20FKEA-Vishay-datasheet-12001583.pdf?src-supplier=RS+(Formerly+Allied+Electronics); ComponentLink27URL: https://datasheet.octopart.com:443/CRCW08058K20FKEA-Vishay-datasheet-190005712.pdf?src-supplier=TME; ComponentLink27Description: https://datasheet.octopart.com:443/CRCW08058K20FKEA-Vishay-datasheet-190005712.pdf?src-supplier=TME; ComponentLink28URL: https://datasheet.octopart.com:443/CRCW08058K20FKEA-Vishay-datasheet-11540273.pdf?src-supplier=Arrow+Electronics; ComponentLink28Description: https://datasheet.octopart.com:443/CRCW08058K20FKEA-Vishay-datasheet-11540273.pdf?src-supplier=Arrow+Electronics; ComponentLink29URL: https://datasheet.octopart.com:443/CRCW08058K20FKEA-Vishay-datasheet-8445837.pdf?src-supplier=element14; ComponentLink29Description: https://datasheet.octopart.com:443/CRCW08058K20FKEA-Vishay-datasheet-8445837.pdf?src-supplier=element14; ComponentLink30URL: http://sigma.octopart.com:80/rohs_statement/Vishay-company-15.pdf?src-supplier=Compliance+Statements; ComponentLink30Description: http://sigma.octopart.com:80/rohs_statement/Vishay-company-15.pdf?src-supplier=Compliance+Statements; LCSC Part Number: C844640
R38 = RC0805FR-07470RL: RES 470Ω 1% 1/8W 0805; Manufacturer: Yageo Group; Max Power Dissipation: 125mW; Temperature Coefficient: 100ppm/°C; Voltage Rating: 150V; Supplier: Future Electronics; Supplier Part Number: RC0805FR-07470RL; Manufacturer Part Number: RC0805FR-07470RL; RoHS: Compliant; Category: Chip SMD Resistors; Stock: 335000; Pricing: 5000=0.0068, 20000=0.0066, 75000=0.0064, 150000=0.0063, 375000=0.006 (USD); Case/Package: 0805; Case Code (Imperial): 0805; China RoHS: Non-Compliant; Composition: Thick Film; Contact Plating: Tin; Country of Origin: Mainland China, Taiwan; Depth: 1.25mm; Export Control Classification Number (ECCN) Code: EAR99; Features: Moisture Resistant; Height: 500µm; Harmonized Tariff Schedule (HTS) Code: 8533.21.00.30; Introduction Date: 2004-09-22; Lead Free: Lead Free; Lead Pitch: 400µm; Length: 2mm; Lifecycle Status: Production; Max Operating Temperature: 155°C; Military Standard: Not; Min Operating Temperature: -55°C; Mounting Technology: Surface Mount; Pins: 2; Number of Terminals: 2; Number of Terminations: 2; Packaging: Tape & Reel; Power Rating: 125mW; Radiation Hardening: No; REACH SVHC: Unaffected; Value: 470Ω; Schedule B: 8533210045, 8533210045|8533210045|8533210045|8533210045|8533210045|8533210045|8533210045|8533210045|8533210045|8533210045|8533210045|8533210045|8533210045|8533210045|8533210045|8533210045|8533210045|8533210045|8533210045|8533210045|8533210045|8533210045|8533210045|85; Termination: SMD/SMT; Tolerance: 1%; Voltage Rating (AC): 150V; Voltage Rating (DC): 150V; Width: 1.25mm; Working Voltage: 150V; ComponentLink1URL: https://datasheet.octopart.com:443/RC0805FR-07470RL-Yageo-datasheet-175887523.pdf?src-supplier=Newark; ComponentLink1Description: https://datasheet.octopart.com:443/RC0805FR-07470RL-Yageo-datasheet-175887523.pdf?src-supplier=Newark; ComponentLink2URL: https://datasheet.octopart.com:443/RC0805FR-07470RL-Yageo-Group-datasheet-190051977.pdf?src-supplier=Newark; ComponentLink2Description: https://datasheet.octopart.com:443/RC0805FR-07470RL-Yageo-Group-datasheet-190051977.pdf?src-supplier=Newark; ComponentLink3URL: https://datasheet.octopart.com:443/RC0805FR-07470RL-Yageo-datasheet-103092701.pdf?src-supplier=Upverter; ComponentLink3Description: https://datasheet.octopart.com:443/RC0805FR-07470RL-Yageo-datasheet-103092701.pdf?src-supplier=Upverter; ComponentLink4URL: https://datasheet.octopart.com:443/RC0805FR-07470RL-Yageo-datasheet-98239111.pdf?src-supplier=Upverter; ComponentLink4Description: https://datasheet.octopart.com:443/RC0805FR-07470RL-Yageo-datasheet-98239111.pdf?src-supplier=Upverter; ComponentLink5URL: https://datasheet.octopart.com:443/RC0805FR-07470RL-Yageo-datasheet-8330313.pdf?src-supplier=element14+APAC; ComponentLink5Description: https://datasheet.octopart.com:443/RC0805FR-07470RL-Yageo-datasheet-8330313.pdf?src-supplier=element14+APAC; ComponentLink6URL: https://datasheet.octopart.com:443/RC0805FR-07470RL-Yageo-datasheet-62067350.pdf?src-supplier=Farnell; ComponentLink6Description: https://datasheet.octopart.com:443/RC0805FR-07470RL-Yageo-datasheet-62067350.pdf?src-supplier=Farnell; ComponentLink7URL: https://datasheet.octopart.com:443/RC0805FR-07470RL-Yageo-datasheet-13691069.pdf?src-supplier=Farnell; ComponentLink7Description: https://datasheet.octopart.com:443/RC0805FR-07470RL-Yageo-datasheet-13691069.pdf?src-supplier=Farnell; ComponentLink8URL: https://datasheet.octopart.com:443/RC0805FR-07470RL-Yageo-Group-datasheet-176638170.pdf?src-supplier=Future+Electronics; ComponentLink8Description: https://datasheet.octopart.com:443/RC0805FR-07470RL-Yageo-Group-datasheet-176638170.pdf?src-supplier=Future+Electronics; ComponentLink9URL: https://datasheet.octopart.com:443/RC0805FR-07470RL-Yageo-datasheet-164759695.pdf?src-supplier=Future+Electronics; ComponentLink9Description: https://datasheet.octopart.com:443/RC0805FR-07470RL-Yageo-datasheet-164759695.pdf?src-supplier=Future+Electronics; ComponentLink10URL: https://datasheet.octopart.com:443/RC0805FR-07470RL-Yageo-datasheet-12592811.pdf?src-supplier=Future+Electronics; ComponentLink10Description: https://datasheet.octopart.com:443/RC0805FR-07470RL-Yageo-datasheet-12592811.pdf?src-supplier=Future+Electronics; ComponentLink11URL: https://datasheet.octopart.com:443/RC0805FR-07470RL-Yageo-datasheet-8324252.pdf?src-supplier=Future+Electronics; ComponentLink11Description: https://datasheet.octopart.com:443/RC0805FR-07470RL-Yageo-datasheet-8324252.pdf?src-supplier=Future+Electronics; ComponentLink12URL: https://datasheet.octopart.com:443/RC0805FR-07470RL-Yageo-datasheet-79472498.pdf?src-supplier=Megastar; ComponentLink12Description: https://datasheet.octopart.com:443/RC0805FR-07470RL-Yageo-datasheet-79472498.pdf?src-supplier=Megastar; ComponentLink13URL: https://datasheet.octopart.com/RC0805FR-07470RL-Yageo-datasheet-73766026.pdf; ComponentLink13Description: https://datasheet.octopart.com/RC0805FR-07470RL-Yageo-datasheet-73766026.pdf; ComponentLink14URL: https://datasheet.octopart.com:443/RC0805FR-07470RL-Yageo-datasheet-118657.pdf?src-supplier=DigiKey; ComponentLink14Description: https://datasheet.octopart.com:443/RC0805FR-07470RL-Yageo-datasheet-118657.pdf?src-supplier=DigiKey; ComponentLink15URL: https://datasheet.octopart.com:443/RC0805FR-07470RL-Yageo-datasheet-502840.pdf?src-supplier=element14; ComponentLink15Description: https://datasheet.octopart.com:443/RC0805FR-07470RL-Yageo-datasheet-502840.pdf?src-supplier=element14; ComponentLink16URL: http://sigma.octopart.com:80/conflict_mineral_statement/Yageo-company-3.pdf?src-supplier=Compliance+Statements; ComponentLink16Description: http://sigma.octopart.com:80/conflict_mineral_statement/Yageo-company-3.pdf?src-supplier=Compliance+Statements; ComponentLink17URL: http://sigma.octopart.com:80/rohs_statement/Yageo-company-2.pdf?src-supplier=Compliance+Statements; ComponentLink17Description: http://sigma.octopart.com:80/rohs_statement/Yageo-company-2.pdf?src-supplier=Compliance+Statements
R39 = FRC0805F2203TS: RES 220kΩ ±1% 125mW 0805; LCSC Part Number: C2907242; Value: 220kΩ
R41 = FRC0805F6801TS: RES 6.8kΩ ±1% 125mW 0805; Value: 6.8kΩ; LCSC Part Number: C2907276
U1 U2 U4 U5 = SI2301CDS-T1-GE3: MOSFET P-CH 20V 3.1A SOT23-3; Manufacturer_Name: Vishay; Copyright: Copyright (C) 2026 Ultra Librarian. All rights reserved.; Manufacturer_Part_Number: SI2301CDS-T1-GE3; RefDes: RefDes; Type: Type; LCSC Part Number: C10487
U3 = IRM-05-5: AC/DC CONVERTER 5V 5W; Manufacturer: Mean Well; Approvals: CB, CE, IEC, TUV, UL; Current - Output 1: 1A; Efficiency: 71%; Max Supply Voltage: 305V; Max Output Voltage: 5.125V; Min Input Voltage: 85V; Min Output Voltage: 4.875V; Nominal Supply Voltage: 115V; Number of Circuits: 1; Supplier: Arrow Electronics; Supplier Part Number: IRM-05-5; Manufacturer Part Number: IRM-05-5; RoHS: Compliant; Category: Power Supply Modules; Stock: 18160; Pricing: 1=7.467, 20=7.35, 50=7.162 (USD); Composition: Hybrid; Export Control Classification Number (ECCN) Code: EAR99; Height: 21.5mm; Height - Seated (Max): 21.5mm; Introduction Date: 2013-07-05; Lead Free: Lead Free; Length: 45.7mm; Lifecycle Status: Production; Max Operating Temperature: 70°C; Max Output current: 1A; Max Output Power: 5W; Max Power Dissipation: 5W; Min Operating Temperature: -30°C; Min Supply Voltage: 85V; Mounting Technology: PCB, Through Hole; Nominal Output Voltage: 5V; Number of Outputs: 1; Pins: 4; Number of Terminals: 4; Output Current: 1A; Output Power: 5W; Output Voltage: 5V; REACH SVHC: Unaffected; Voltage - Output 1: 5V; Weight: 39.999986g; Width: 25.4mm; ComponentLink1URL: https://datasheet.octopart.com:443/IRM-05-5-Mean-Well-datasheet-180626755.pdf?src-supplier=IHS; ComponentLink1Description: https://datasheet.octopart.com:443/IRM-05-5-Mean-Well-datasheet-180626755.pdf?src-supplier=IHS; ComponentLink2URL: https://datasheet.octopart.com:443/IRM-05-5-Mean-Well-datasheet-101610177.pdf?src-supplier=Farnell; ComponentLink2Description: https://datasheet.octopart.com:443/IRM-05-5-Mean-Well-datasheet-101610177.pdf?src-supplier=Farnell; ComponentLink3URL: https://datasheet.octopart.com:443/IRM-05-5-Mean-Well-datasheet-67333141.pdf?src-supplier=Sager+Power+Systems; ComponentLink3Description: https://datasheet.octopart.com:443/IRM-05-5-Mean-Well-datasheet-67333141.pdf?src-supplier=Sager+Power+Systems; ComponentLink4URL: https://datasheet.octopart.com:443/IRM-05-5-Mean-Well-datasheet-154740696.pdf?src-supplier=Master+Electronics; ComponentLink4Description: https://datasheet.octopart.com:443/IRM-05-5-Mean-Well-datasheet-154740696.pdf?src-supplier=Master+Electronics; ComponentLink5URL: https://datasheet.octopart.com:443/IRM-05-5-Mean-Well-datasheet-34148673.pdf?src-supplier=Future+Electronics; ComponentLink5Description: https://datasheet.octopart.com:443/IRM-05-5-Mean-Well-datasheet-34148673.pdf?src-supplier=Future+Electronics; ComponentLink6URL: https://datasheet.octopart.com:443/IRM-05-5-Mean-Well-datasheet-27625340.pdf?src-supplier=Jameco+(USA); ComponentLink6Description: https://datasheet.octopart.com:443/IRM-05-5-Mean-Well-datasheet-27625340.pdf?src-supplier=Jameco+(USA); ComponentLink7URL: https://datasheet.octopart.com:443/IRM-05-5-Mean-Well-datasheet-19208722.pdf?src-supplier=Telerex+Europe; ComponentLink7Description: https://datasheet.octopart.com:443/IRM-05-5-Mean-Well-datasheet-19208722.pdf?src-supplier=Telerex+Europe; ComponentLink8URL: https://datasheet.octopart.com:443/IRM-05-5-Mean-Well-datasheet-194193599.pdf?src-supplier=LCSC; ComponentLink8Description: https://datasheet.octopart.com:443/IRM-05-5-Mean-Well-datasheet-194193599.pdf?src-supplier=LCSC; ComponentLink9URL: https://datasheet.octopart.com:443/IRM-05-5-Mean-Well-datasheet-158921293.pdf?src-supplier=Component+Distributors+Inc.; ComponentLink9Description: https://datasheet.octopart.com:443/IRM-05-5-Mean-Well-datasheet-158921293.pdf?src-supplier=Component+Distributors+Inc.; ComponentLink10URL: https://datasheet.octopart.com:443/IRM-05-5-Mean-Well-datasheet-137204475.pdf?src-supplier=Component+Distributors+Inc.; ComponentLink10Description: https://datasheet.octopart.com:443/IRM-05-5-Mean-Well-datasheet-137204475.pdf?src-supplier=Component+Distributors+Inc.; ComponentLink11URL: https://datasheet.octopart.com:443/IRM-05-5-Mean-Well-datasheet-151511263.pdf?src-supplier=TME; ComponentLink11Description: https://datasheet.octopart.com:443/IRM-05-5-Mean-Well-datasheet-151511263.pdf?src-supplier=TME; ComponentLink12URL: https://datasheet.octopart.com:443/IRM-05-5-Mean-Well-datasheet-151511270.pdf?src-supplier=TME; ComponentLink12Description: https://datasheet.octopart.com:443/IRM-05-5-Mean-Well-datasheet-151511270.pdf?src-supplier=TME; ComponentLink13URL: https://datasheet.octopart.com:443/IRM-05-5-Mean-Well-datasheet-83579035.pdf?src-supplier=TME; ComponentLink13Description: https://datasheet.octopart.com:443/IRM-05-5-Mean-Well-datasheet-83579035.pdf?src-supplier=TME; ComponentLink14URL: https://datasheet.octopart.com:443/IRM-05-5-Mean-Well-datasheet-24998212.pdf?src-supplier=TME; ComponentLink14Description: https://datasheet.octopart.com:443/IRM-05-5-Mean-Well-datasheet-24998212.pdf?src-supplier=TME; ComponentLink15URL: https://datasheet.octopart.com:443/IRM-05-5-Mean-Well-datasheet-140567947.pdf?src-supplier=Arrow.cn; ComponentLink15Description: https://datasheet.octopart.com:443/IRM-05-5-Mean-Well-datasheet-140567947.pdf?src-supplier=Arrow.cn; LCSC Part Number: C48603696